# EasyEDA Pro project lazy_led.epro

# Schematic 懒人关灯
Board Name: Board1; Create Date: 2025-05-22; Page Name: P1; Project Name: esp8266_for_led; Schematic Name: 懒人关灯; Update Date: 2025-05-24; Company: 嘉立创EDA; Page Size: A4; Version: V1.0
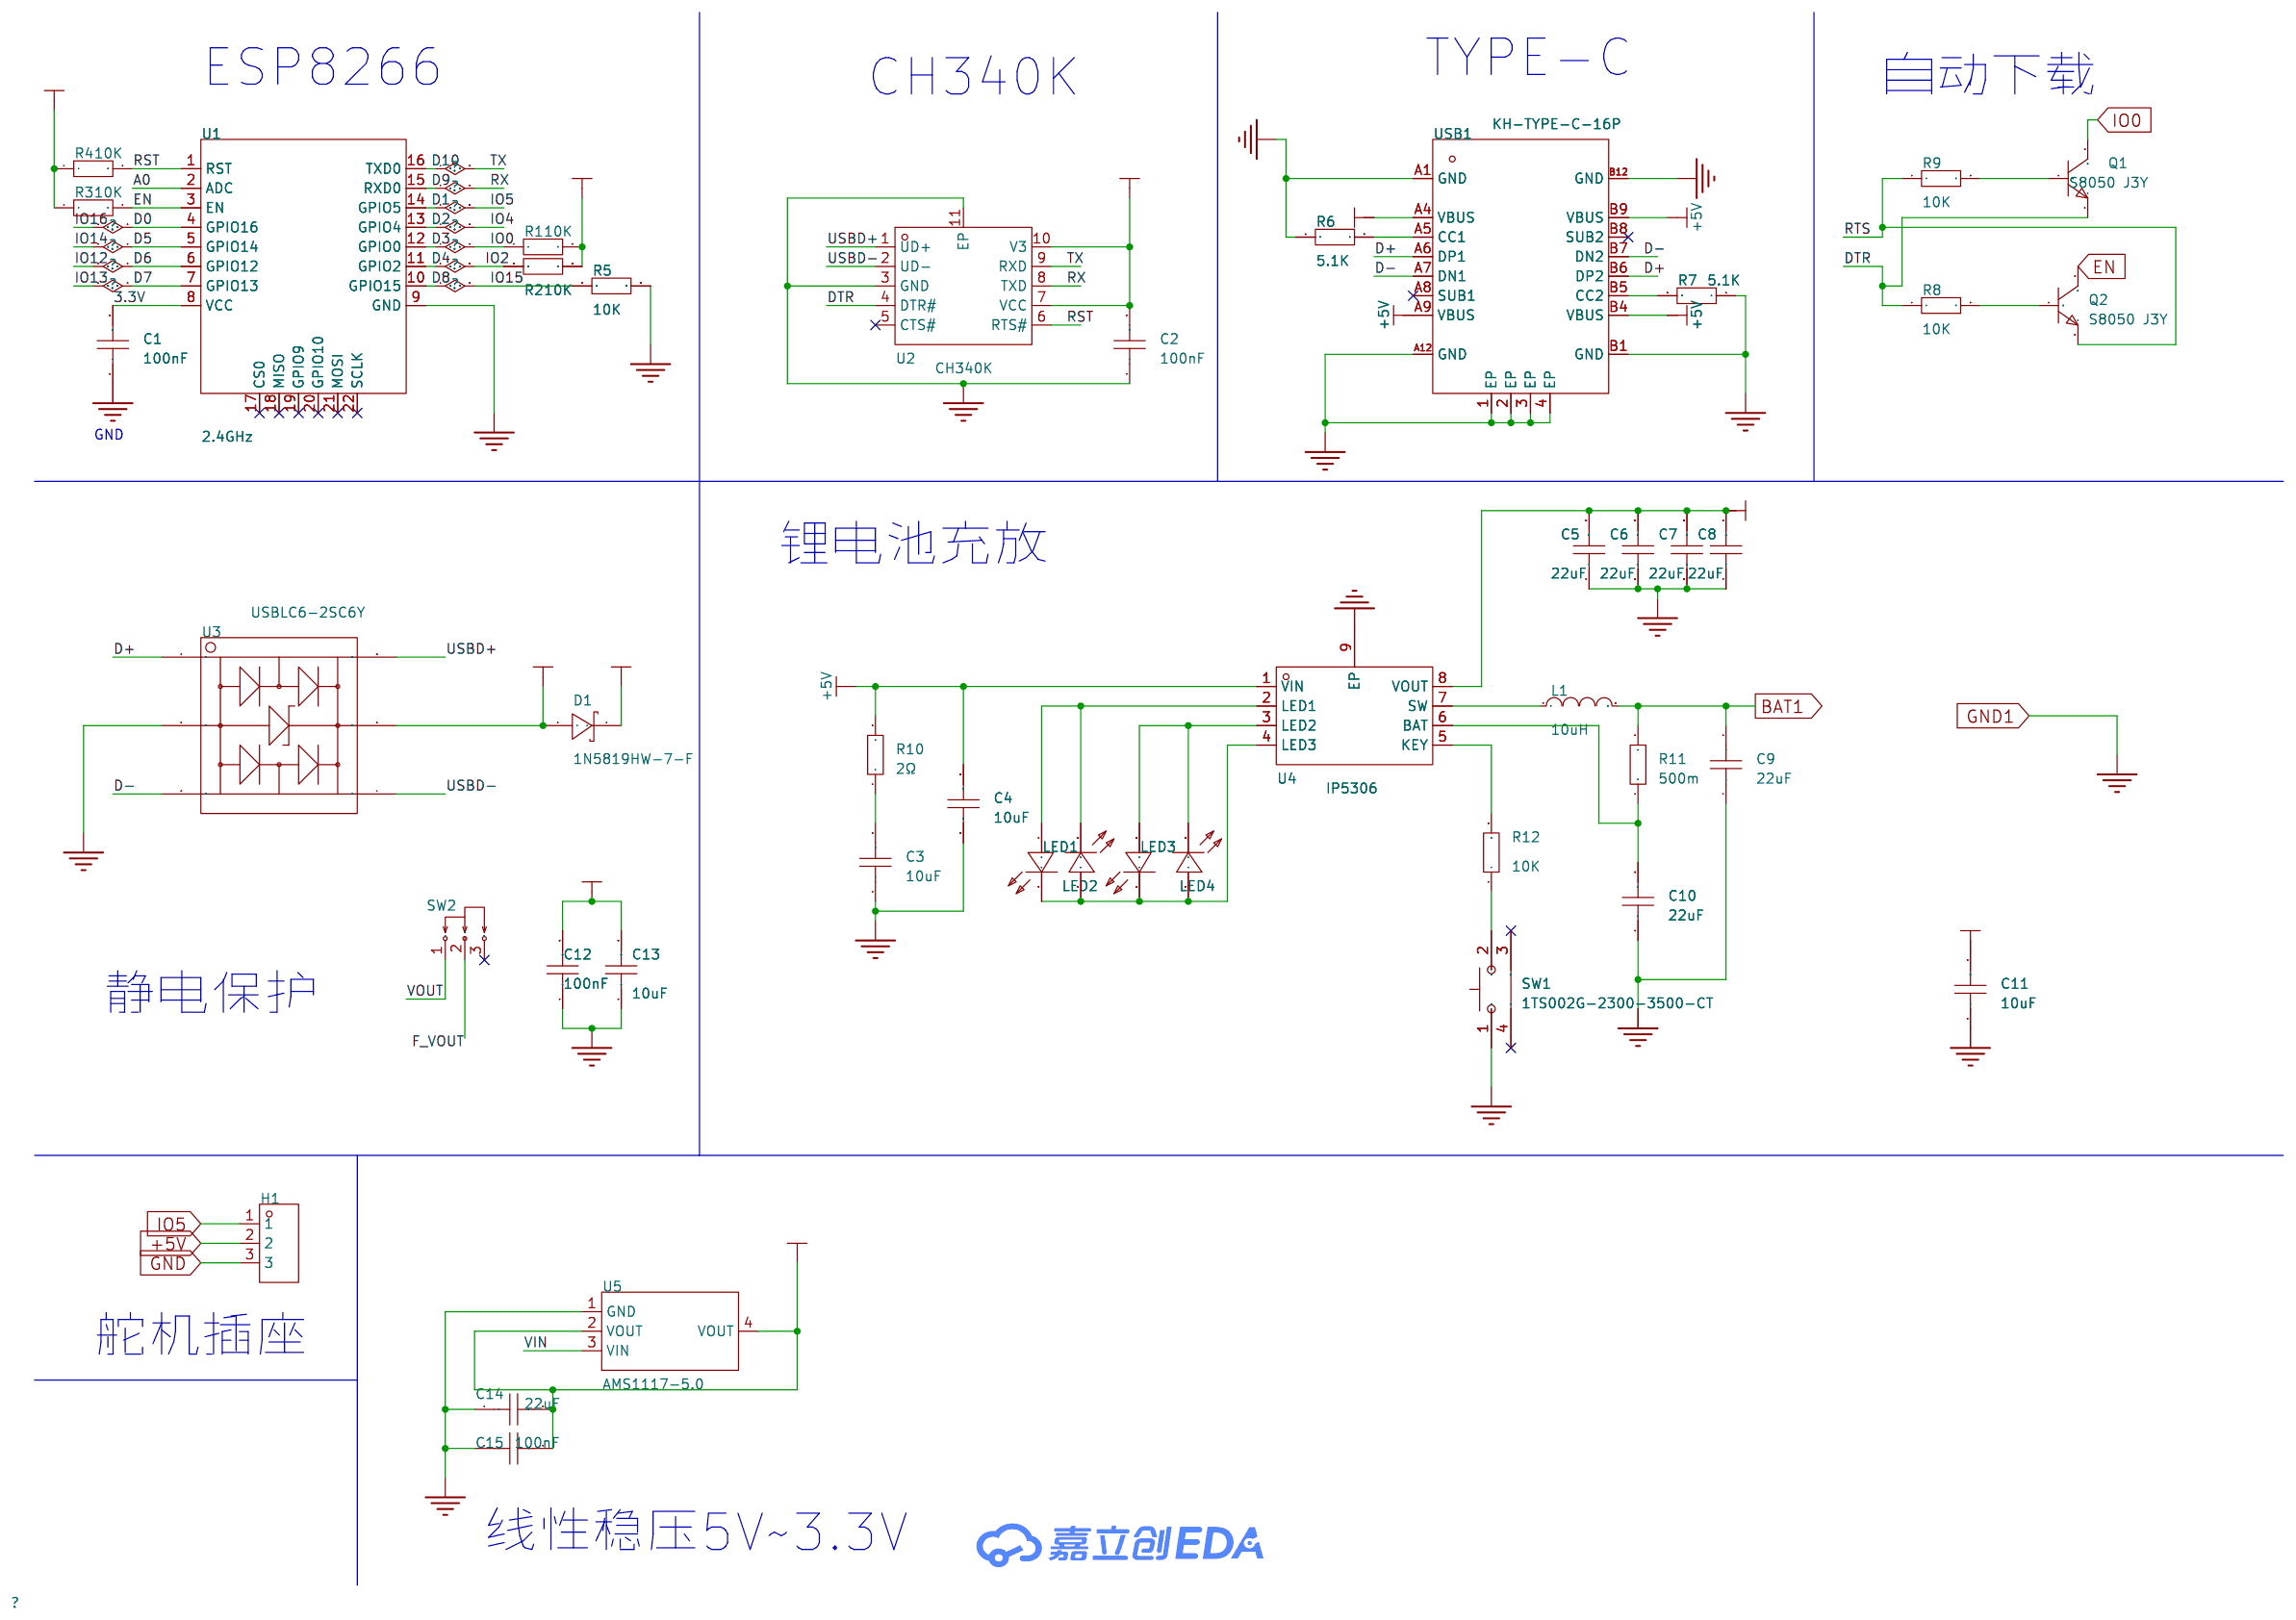
[diagram p0: schematic sheet]

## Parts
C1  100nF  [C0603]
C2  100nF  [C0603]
C3  10uF  [C0603]
C4  10uF  [C0603]
C5  22uF  [C0603]
C6  22uF  [C0603]
C7  22uF  [C0603]
C8  22uF  [C0603]
C9  22uF  [C0603]
C10  22uF  [C0603]
C11  10uF  [C0603]
C12  100nF  [C0603]
C13  10uF  [C0603]
C14  22uF  [C0603]
C15  100nF  [C0603]
D1  1N5819HW-7-F  [SOD-123_L2.7-W1.6-LS3.7-RD]
H1  PZ254V-11-03P-YL  [HDR-TH_PZ254V-11-03P-YL]
L1  10uH  [L0603]
LED1  KT-0805G  [LED0805-R-RD]
LED2  KT-0805G  [LED0805-R-RD]
LED3  KT-0805G  [LED0805-R-RD]
LED4  KT-0805G  [LED0805-R-RD]
Q1  S8050 J3Y  [SOT-23-3_L3.0-W1.7-P0.95-LS2.9-BR]
Q2  S8050 J3Y  [SOT-23-3_L3.0-W1.7-P0.95-LS2.9-BR]
R1  10K  [R0603]
R2  10K  [R0603]
R3  10K  [R0603]
R4  10K  [R0603]
R5  10K  [R0603]
R6  5.1K  [R0603]
R7  5.1K  [R0603]
R8  10K  [R0603]
R9  10K  [R0603]
R10  2Ω  [R0603]
R11  500m  [R0603]
R12  10K  [R0603]
SW1  1TS002G-2300-3500-CT  [KEY-SMD_1TS002G]
SW2  SS12D10G4 071  [SW-TH_SHOU-HAN_SS12D10G4]
U1  2.4GHz  [WIFIM-SMD_ESP-12F-ESP8266MOD]
U2  CH340K  [ESOP-10_L4.9-W3.9-P1.00-LS6.2-BL-EP]
U3  USBLC6-2SC6Y  [SOT-23-6_L2.9-W1.6-P0.95-LS2.8-BL]
U4  IP5306  [ESOP-8_L4.9-W3.9-P1.27-LS6.0-BL-EP]
U5  AMS1117-5.0  [SOT-223_L6.5-W3.5-P2.30-LS7.0-BR]
USB1  KH-TYPE-C-16P  [USB-C-SMD_KH-TYPE-C-16P]

## Library data of the parts
C1-C15 = CAP_0603: Supplier Footprint: 0603
D1 = 1N5819HW-7-F: 正向压降(Vf):450mV@1A;直流反向耐压(Vr):40V;整流电流:1A;; LCSC Part Name: 电压:40V 电流:1A; Supplier Part: C82544; Manufacturer: DIODES(美台); Supplier Footprint: SOD-123; JLCPCB Part Class: 扩展库; Datasheet: https://atta.szlcsc.com/upload/public/pdf/source/20161024/1477288459223.pdf; Supplier: LCSC; Forward Voltage (Vf@If): 450mV@1A; Reverse Voltage (Vr): 40V; Rectified Current: 1A; Reverse Leakage Current (Ir): 1mA@40V
H1 = PZ254V-11-03P-YL: 排针2.54mm间距 直插 1x03位 黄色胶芯; Supplier Part: C41425306; Manufacturer: XFCN(兴飞); Supplier Footprint: 插件,P=2.54mm; JLCPCB Part Class: 扩展库; Datasheet: https://atta.szlcsc.com/upload/public/pdf/source/20241009/C227763597A5D58F5275B212435FDB0D.pdf; Supplier: LCSC
L1 = L_0603
LED1-LED4 = KT-0805G: 灯头类型:-;发光颜色:翠绿色;正向电压(VF):-;功率:-;正向电流:-;主波长:-;二极管配置:-;透镜颜色:-;色温:-;发光强度:-;发光角度:-;载带方式:-;工作温度:-;; LCSC Part Name: 0805 翠绿 高亮; Supplier Part: C2297; Manufacturer: KENTO; Supplier Footprint: 0805; JLCPCB Part Class: 基础库; Datasheet: https://atta.szlcsc.com/upload/public/pdf/source/20170209/1486607340485.pdf; Supplier: LCSC; Emitted Color: 翠绿色
Q1 Q2 = S8050 J3Y(RANGE:200-350): 晶体管类型:NPN;集电极电流(Ic):500mA;集射极击穿电压(Vceo):25V;耗散功率(Pd):300mW;直流电流增益(hFE):200@500mA,1V;; LCSC Part Name: H档(200-350); Supplier Part: C2146; Manufacturer: CJ(江苏长电/长晶); Supplier Footprint: SOT-23; JLCPCB Part Class: 基础库; Datasheet: https://atta.szlcsc.com/upload/public/pdf/source/20231013/FF37B6A000E6CDA75C9C999D2E78731F.pdf; Supplier: LCSC; type: NPN; Current - Collector(Ic): 500mA; Collector - Emitter Voltage VCEO: 25V; Pd - Power Dissipation: 300mW; DC Current Gain: 200@500mA,1V; Transition frequency(fT): 150MHz; Current - Collector Cutoff: 100nA; Vce Saturation(VCE(sat)): 600mV; Operating Temperature: -55℃~+150℃
R1-R12 = Res_0603: Supplier Footprint: 0603
SW1 = 1TS002G-2300-3500-CT: 电路结构:单刀单掷;按钮形状:矩形按钮;作用力:230gf;安装方式:卧贴;开关长度:7.6mm;开关宽度:3.5mm;开关高度:3.5mm;带支架:不带;触点电流:50mA;额定电压(DC):12V;额定功率:0.6W;绝缘电阻:100MΩ;带灯:无;机械寿命:3万次;; LCSC Part Name: 7.6*3.5*3.5mm 卧贴 轻触开关; Supplier Part: C319377; Manufacturer: HYP(鸿源精密); Supplier Footprint: SMD,3.5x7.6mm; JLCPCB Part Class: 扩展库; Datasheet: https://atta.szlcsc.com/upload/public/pdf/source/20181106/C319377_FDC1FB9730904BE1C6DB205F4DA5523F.pdf; Supplier: LCSC; Circuit: 单刀单掷; Actuator Style: 矩形按钮; Operating Force: 230gf; Mounting Style: 卧贴; Switch Length: 7.6mm; Switch Width: 3.5mm; Switch Height: 3.5mm; Strike Gundam: 不带; Contact Current: 50mA; Voltage Rating (DC): 12V; Power Rating: 0.6W; Insulation Resistance: 100MΩ; Actuator/Cap Color: 黑色; With Lamp: 无; Pin Style: J型引脚; Mechanical Life: 3万次; Operating Temperature: -40℃~+90℃
SW2 = SS12D10G4 071: 电路结构:单刀双掷;安装方式:直插;开关颜色:-;额定电流(DC):2A;额定电压(DC):125V;额定电流(AC):-;额定电压(AC):-;机械寿命:3千次;; Supplier Part: C2887259; Manufacturer: SHOU HAN(首韩); Supplier Footprint: 插件; JLCPCB Part Class: 扩展库; Datasheet: https://atta.szlcsc.com/upload/public/pdf/source/20210820/80D1704BBF3FCEE0435FCAA54C61E0A3.pdf; Supplier: LCSC; Circuit: 单刀双掷; Pin Style: PC引脚; Switch Length: 12.7mm; Switch Width: 6.7mm; Switch Height: 6.4mm; Mounting Style: 直插; Current Rating (DC): 2A; Voltage Rating (DC): 125V; Mechanical Life: 3千次; Operating Temperature: -16℃~+60℃
U1 = ESP-12F(ESP8266MOD): 核心处理器:ESP8266芯片;频率:2.4GHz;天线形式:板载PCB天线;发射功率:16dBm;接收灵敏度:-90dBm;; LCSC Part Name: 完整的802.11b/g/nWi-FiSoC模块 屏蔽罩上的丝印是：ESP8266MOD，ESP8266EX串口WIFI; Supplier Part: C82891; Manufacturer: Ai-Thinker(安信可); Supplier Footprint: SMD,16x24mm; JLCPCB Part Class: 扩展库; Datasheet: https://atta.szlcsc.com/upload/public/pdf/source/20210219/C82891_ABD84A460F4F056A2757267CCCA4B508.pdf; Supplier: LCSC; Core Processor: ESP8266芯片; Support Interface: GPIO；UART；I2C；PWM；SPI；ADC; Antenna Type: 板载PCB天线; Output Power: 16dBm; Operating Voltage: 3.3V; Receive  Current: 120mA; Send  Current: 170mA; Sensitivity: -90dBm; Operating Temperature: -40℃~+85℃
U2 = CH340K: 应用功能:USB转串口;接口协议:USB 2.0;通道数:-;数据速率:2Mbps;; LCSC Part Name: USB转串口芯片CH340; Supplier Part: C968586; Manufacturer: WCH(南京沁恒); Supplier Footprint: ESSOP-10-150mil-1mm; JLCPCB Part Class: 扩展库; Datasheet: https://atta.szlcsc.com/upload/public/pdf/source/20240313/C21A12AB66F63ABF8F8743FF13A35C95.pdf; Supplier: LCSC; Applications Function: USB转串口; Protocol: USB 2.0; Voltage - Supply: 3.3V；5V; Data Rate: 2Mbps; Operating Temperature: -20℃~+70℃
U3 = USBLC6-2SC6Y: Supplier Part: C5310974; Manufacturer: TECH PUBLIC(台舟); Supplier Footprint: SOT-23-6; JLCPCB Part Class: 扩展库; Datasheet: https://atta.szlcsc.com/upload/public/pdf/source/20221212/069345D45678B0F27086425C11086B50.pdf; Supplier: LCSC
U4 = IP5306: 2.1A充电2.4A放电高集成度移动电源SOC; Supplier Part: C181692; Manufacturer: INJOINIC(英集芯); Supplier Footprint: ESOP-8; JLCPCB Part Class: 扩展库; Datasheet: https://atta.szlcsc.com/upload/public/pdf/source/20190627/C384572_9925B3DDC4041BC6108E5AB46A2A0AB1.pdf; Supplier: LCSC
U5 = AMS1117-5.0_C6187: 输出类型:固定;工作电压:12V;输出电压:5V;输出电流:1A;电源纹波抑制比(PSRR):-;输出极性:正极;; LCSC Part Name: 输入12V 输出5V 1A; Supplier Part: C6187; Manufacturer: AMS; Supplier Footprint: SOT-223; JLCPCB Part Class: 基础库; Datasheet: https://atta.szlcsc.com/upload/public/pdf/source/20230918/E4B716057EE82179D88E8A0894830D59.pdf; Supplier: LCSC; Output Type: 固定; Voltage - Supply: 12V; Output Voltage: 5V; Output Current: 1A; Voltage Dropout: 1.3V@(1A); Features: 过流保护(OCP); Output Configuration: 正极; Number of Outputs: 1
USB1 = KH-TYPE-C-16P: 连接器类型:Type-C;标准:-;公母:母;端口数量:1;触点数量:16P;安装方式:卧贴;额定电流 - 电源:3A;工作温度范围:-40℃~+85℃;; LCSC Part Name: Type-C 母 卧贴; Supplier Part: C709357; Manufacturer: kinghelm(金航标); Supplier Footprint: SMD; JLCPCB Part Class: 扩展库; Datasheet: https://atta.szlcsc.com/upload/public/pdf/source/20200911/C709357_AA8DCEB38BB20E3035A7ED7AE7667837.pdf; Supplier: LCSC; Connector Type: Type-C; Gender: 母; Number of Ports: 1; Number of Contacts: 16P; Mounting Style: 卧贴; Current Rating - Power (Max): 3A; Operating Temperature Range: -40℃~+85℃

## Nets
3.3V: C1.2 U1.8(VCC)
+3.3V: C2.2 C14.2 C15.2 R1.2 R2.2 R3.1 R4.1 U2.7(VCC) U2.10(V3) U5.2(VOUT) U5.4(VOUT)
+5V: C4.2 H1.2 R10.2 U4.1(VIN) USB1.A4(VBUS) USB1.A9(VBUS) USB1.B4(VBUS) USB1.B9(VBUS)
GND: C1.1 C2.1 C3.1 C4.1 C5.1 C6.1 C7.1 C8.1 C9.1 C10.1 C11.1 C12.1 C13.1 C14.1 C15.1 H1.3 R5.2 R6.1 R7.1 SW1.1 U1.9(GND) U2.3(GND) U2.11(EP) U3.2(GND) U4.9(EP) U5.1(GND) USB1.1(EP) USB1.2(EP) USB1.3(EP) USB1.4(EP) USB1.A1(GND) USB1.A12(GND) USB1.B1(GND) USB1.B12(GND)
VIN: C11.2 D1.1(K) U5.3(VIN)
A0: U1.2(ADC)
BAT1: C9.2 L1.2 R11.2
D0: U1.4(GPIO16)
D1: H1.1 U1.14(GPIO5)
D2: U1.13(GPIO4)
D3: Q1.3(C) R1.1 U1.12(GPIO0)
D4: R2.1 U1.11(GPIO2)
D5: U1.5(GPIO14)
D6: U1.6(GPIO12)
D7: U1.7(GPIO13)
D8: R5.1 U1.10(GPIO15)
D9: U1.15(RXD0) U2.8(TXD)
D10: U1.16(TXD0) U2.9(RXD)
D+: U3.1(I/O1) USB1.A6(DP1) USB1.B6(DP2)
D-: U3.3(I/O2) USB1.A7(DN1) USB1.B7(DN2)
DTR: Q1.2(E) R8.1 U2.4(DTR#)
EN: Q2.3(C) R3.2 U1.3(EN)
F_VOUT: C12.2 C13.2 D1.2(A) SW2.2 U3.5(VBUS)
RST: R4.2 U1.1(RST) U2.6(RTS#)
RTS: Q2.2(E) R9.1
USBD+: U2.1(UD+) U3.6(I/O1)
USBD-: U2.2(UD-) U3.4(I/O2)
VOUT: C5.2 C6.2 C7.2 C8.2 SW2.1 U4.8(VOUT)
Net-(C3-2): C3.2 R10.1
Net-(C10-2): C10.2 R11.1 U4.6(BAT)
Net-(L1-1): L1.1 U4.7(SW)
Net-(LED1-1): LED1.1(A) LED2.2(K) U4.2(LED1)
Net-(LED1-2): LED1.2(K) LED2.1(A) LED3.2(K) LED4.1(A) U4.4(LED3)
Net-(LED3-1): LED3.1(A) LED4.2(K) U4.3(LED2)
Net-(Q1-1): Q1.1(B) R9.2
Net-(Q2-1): Q2.1(B) R8.2
Net-(R6-2): R6.2 USB1.A5(CC1)
Net-(R7-2): R7.2 USB1.B5(CC2)
Net-(R12-1): R12.1 SW1.2
Net-(R12-2): R12.2 U4.5(KEY)

Not connected (* = marked no-connect by the designer): SW1 3* 4*; SW2 3*; U1 17(CS0)* 18(MISO)* 19(GPIO9)* 20(GPIO10)* 21(MOSI)* 22(SCLK)*; U2 5(CTS#)*; USB1 A8(SUB1)* B8(SUB2)*

## Notes on the sheet
- ESP8266
- TYPE-C
- CH340K
- 自动下载
- GND
- 锂电池充放
- 静电保护
- 舵机插座
- 线性稳压5V~3.3V
